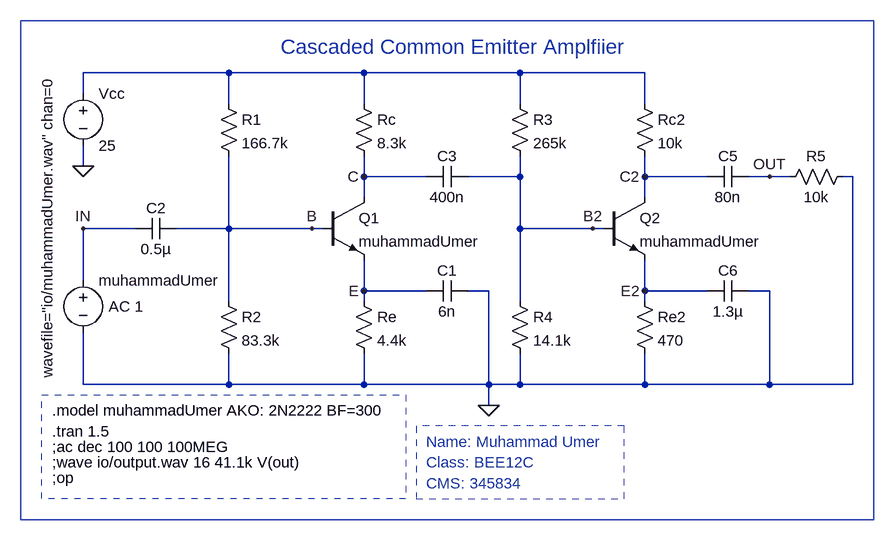
[diagram p0: schematic dual_stage.asc]
dual_stage.asc, the LTspice schematic file:
Version 4
SHEET 1 2160 688
WIRE 96 -192 -128 -192
WIRE 304 -192 96 -192
WIRE 544 -192 304 -192
WIRE 736 -192 544 -192
WIRE -128 -160 -128 -192
WIRE 96 -144 96 -192
WIRE 304 -144 304 -192
WIRE 544 -144 544 -192
WIRE 736 -144 736 -192
WIRE -128 -48 -128 -80
WIRE 304 -32 304 -64
WIRE 400 -32 304 -32
WIRE 544 -32 544 -64
WIRE 544 -32 464 -32
WIRE 736 -32 736 -64
WIRE 832 -32 736 -32
WIRE 928 -32 896 -32
WIRE 960 -32 928 -32
WIRE 1056 -32 1040 -32
WIRE 304 0 304 -32
WIRE 736 0 736 -32
WIRE -48 48 -128 48
WIRE 96 48 96 -64
WIRE 96 48 16 48
WIRE 224 48 96 48
WIRE 240 48 224 48
WIRE 544 48 544 -32
WIRE 656 48 544 48
WIRE 672 48 656 48
WIRE -128 128 -128 48
WIRE 304 144 304 96
WIRE 400 144 304 144
WIRE 496 144 464 144
WIRE 736 144 736 96
WIRE 832 144 736 144
WIRE 928 144 896 144
WIRE 96 160 96 48
WIRE 304 160 304 144
WIRE 544 160 544 48
WIRE 736 160 736 144
WIRE -128 288 -128 208
WIRE 96 288 96 240
WIRE 96 288 -128 288
WIRE 304 288 304 240
WIRE 304 288 96 288
WIRE 496 288 496 144
WIRE 496 288 304 288
WIRE 544 288 544 240
WIRE 544 288 496 288
WIRE 736 288 736 240
WIRE 736 288 544 288
WIRE 928 288 928 144
WIRE 928 288 736 288
WIRE 1056 288 1056 -32
WIRE 1056 288 928 288
WIRE 496 320 496 288
FLAG -128 -48 0
FLAG -128 48 IN
FLAG 304 -32 C
FLAG 304 144 E
FLAG 224 48 B
FLAG 928 -32 OUT
FLAG 496 320 0
FLAG 736 -32 C2
FLAG 656 48 B2
FLAG 736 144 E2
SYMBOL npn 240 0 R0
SYMATTR InstName Q1
SYMATTR Value muhammadUmer
SYMBOL res 288 144 R0
SYMATTR InstName Re
SYMATTR Value 4.4k
SYMBOL res 80 -160 R0
SYMATTR InstName R1
SYMATTR Value 166.7k
SYMBOL res 80 144 R0
SYMATTR InstName R2
SYMATTR Value 83.3k
SYMBOL res 288 -160 R0
SYMATTR InstName Rc
SYMATTR Value 8.3k
SYMBOL res 1056 -48 R90
WINDOW 0 0 56 VBottom 2
WINDOW 3 32 56 VTop 2
SYMATTR InstName R5
SYMATTR Value 10k
SYMBOL cap 464 128 R90
WINDOW 0 0 32 VBottom 2
WINDOW 3 32 32 VTop 2
SYMATTR InstName C1
SYMATTR Value 6n
SYMBOL cap 16 32 R90
WINDOW 0 0 32 VBottom 2
WINDOW 3 32 32 VTop 2
SYMATTR InstName C2
SYMATTR Value 0.5µ
SYMBOL cap 464 -48 R90
WINDOW 0 0 32 VBottom 2
WINDOW 3 32 32 VTop 2
SYMATTR InstName C3
SYMATTR Value 400n
SYMBOL voltage -128 112 R0
WINDOW 3 -55 -301 VRight 2
WINDOW 123 39 56 Left 2
SYMATTR Value wavefile="io/muhammadUmer.wav" chan=0
SYMATTR Value2 AC 1
SYMATTR InstName muhammadUmer
SYMBOL voltage -128 -176 R0
SYMATTR InstName Vcc
SYMATTR Value 25
SYMBOL res 528 -160 R0
SYMATTR InstName R3
SYMATTR Value 265k
SYMBOL res 528 144 R0
SYMATTR InstName R4
SYMATTR Value 14.1k
SYMBOL npn 672 0 R0
SYMATTR InstName Q2
SYMATTR Value muhammadUmer
SYMBOL cap 896 -48 R90
WINDOW 0 0 32 VBottom 2
WINDOW 3 32 32 VTop 2
SYMATTR InstName C5
SYMATTR Value 80n
SYMBOL res 720 144 R0
SYMATTR InstName Re2
SYMATTR Value 470
SYMBOL res 720 -160 R0
SYMATTR InstName Rc2
SYMATTR Value 10k
SYMBOL cap 896 128 R90
WINDOW 0 0 32 VBottom 2
WINDOW 3 32 32 VTop 2
SYMATTR InstName C6
SYMATTR Value 1.3µ
TEXT -176 328 Left 2 !.model muhammadUmer AKO: 2N2222 BF=300
TEXT 176 -232 Left 3 ;Cascaded Common Emitter Amplfiier
TEXT 400 376 Left 2 ;Name: Muhammad Umer
TEXT 400 408 Left 2 ;Class: BEE12C
TEXT 400 440 Left 2 ;CMS: 345834
TEXT -176 360 Left 2 !.tran 1.5
TEXT -176 384 Left 2 !;ac dec 100 100 100MEG
TEXT -176 408 Left 2 !;wave io/output.wav 16 41.1k V(out)
TEXT -176 432 Left 2 !;op
RECTANGLE Normal 704 352 384 464 1
RECTANGLE Normal 368 464 -192 304 1
RECTANGLE Normal 1088 -272 -224 496

The netlist it stands for:
* dual_stage.asc
Q1 C B E 0 muhammadUmer
Re E 0 4.4k
R1 N001 B 166.7k
R2 B 0 83.3k
Rc N001 C 8.3k
R5 0 OUT 10k
C1 0 E 6n
C2 B IN 0.5µ
C3 B2 C 400n
V§muhammadUmer IN 0 wavefile="io/muhammadUmer.wav" chan=0 AC 1
Vcc N001 0 25
R3 N001 B2 265k
R4 B2 0 14.1k
Q2 C2 B2 E2 0 muhammadUmer
C5 OUT C2 80n
Re2 E2 0 470
Rc2 N001 C2 10k
C6 0 E2 1.3µ
.model NPN NPN
.model PNP PNP
.lib standard.bjt
.model muhammadUmer AKO: 2N2222 BF=300
* Cascaded Common Emitter Amplfiier
* Name: Muhammad Umer
* Class: BEE12C
* CMS: 345834
.tran 1.5
;ac dec 100 100 100MEG
;wave io/output.wav 16 41.1k V(out)
;op
.backanno
.end